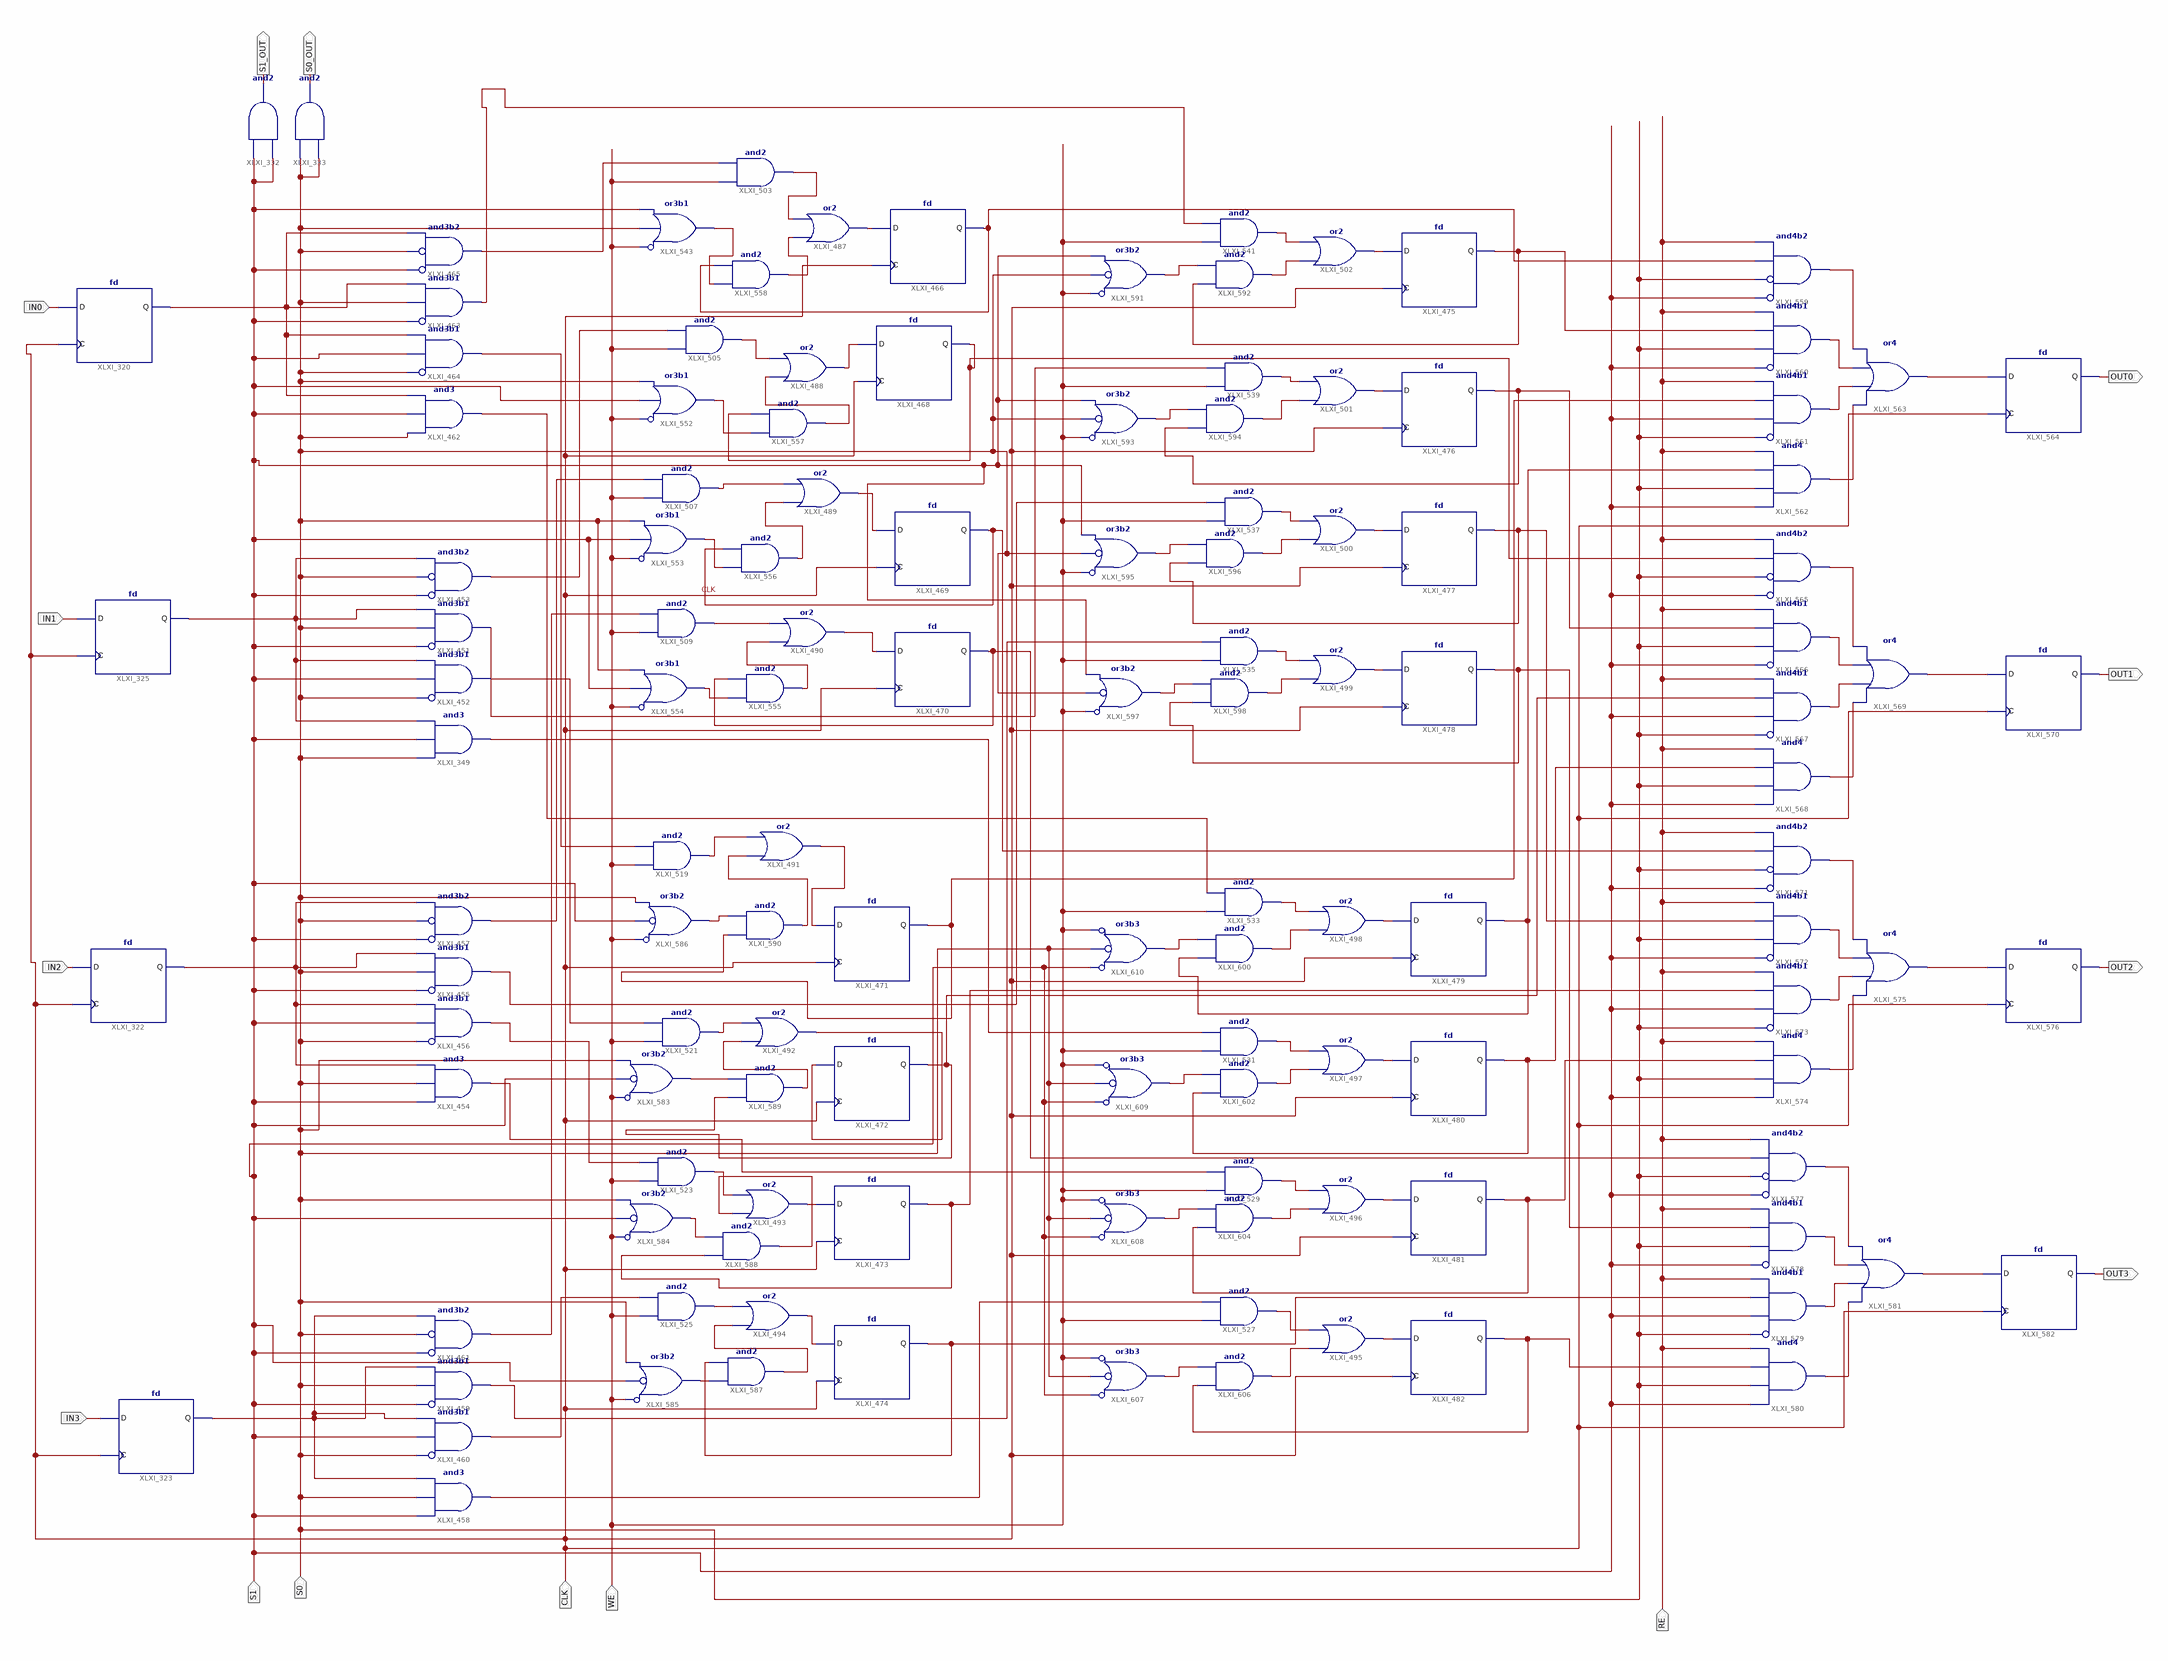
[diagram p0: schematic sheet 1]
// Xilinx ISE schematic regfile2.sch (spartan3e) as structural Verilog: 126 symbols, 15 ports
module regfile2 (
  input  S1,
  input  S0,
  input  IN3,
  input  IN2,
  input  IN1,
  input  IN0,
  input  CLK,
  input  WE,
  input  RE,
  output S1_OUT,
  output S0_OUT,
  output OUT0,
  output OUT1,
  output OUT2,
  output OUT3
);

  wire XLXN_934, XLXN_937, XLXN_940, XLXN_943, XLXN_989, XLXN_990, XLXN_991, XLXN_992, XLXN_993, XLXN_994,
       XLXN_995, XLXN_996, XLXN_997, XLXN_998, XLXN_999, XLXN_1000, XLXN_1001, XLXN_1002, XLXN_1003,
       XLXN_1004, XLXN_1056, XLXN_1057, XLXN_1058, XLXN_1059, XLXN_1060, XLXN_1061, XLXN_1062, XLXN_1063,
       XLXN_1065, XLXN_1067, XLXN_1068, XLXN_1071, XLXN_1073, XLXN_1075, XLXN_1077, XLXN_1079, XLXN_1081,
       XLXN_1083, XLXN_1085, XLXN_1086, XLXN_1088, XLXN_1090, XLXN_1091, XLXN_1092, XLXN_1093, XLXN_1094,
       XLXN_1095, XLXN_1096, XLXN_1097, XLXN_1098, XLXN_1100, XLXN_1126, XLXN_1134, XLXN_1146, XLXN_1151,
       XLXN_1154, XLXN_1155, XLXN_1156, XLXN_1157, XLXN_1158, XLXN_1159, XLXN_1160, XLXN_1161, XLXN_1162,
       XLXN_1163, XLXN_1164, XLXN_1165, XLXN_1166, XLXN_1167, XLXN_1168, XLXN_1169, XLXN_1170, XLXN_1171,
       XLXN_1172, XLXN_1173, XLXN_1174, XLXN_1175, XLXN_1176, XLXN_1201, XLXN_1202, XLXN_1203, XLXN_1204,
       XLXN_1206, XLXN_1207, XLXN_1208, XLXN_1209, XLXN_1215, XLXN_1232, XLXN_1233, XLXN_1234, XLXN_1235,
       XLXN_1236, XLXN_1237, XLXN_1238, XLXN_1240, XLXN_1241, XLXN_1248, XLXN_1249, XLXN_1250, XLXN_1251,
       XLXN_1252, XLXN_1253, XLXN_1254, XLXN_1255, XLXN_1256, XLXN_1257, XLXN_1258, XLXN_1259, XLXN_1262,
       XLXN_1263, XLXN_1264, XLXN_1265, XLXN_1266, XLXN_1267, XLXN_1268, XLXN_1269, XLXN_1270, XLXN_1271,
       XLXN_1272, XLXN_1273;

  and XLXI_332 (S1_OUT, S1, S1);
  and XLXI_333 (S0_OUT, S0, S0);
  and XLXI_349 (XLXN_1203, S0, S1, XLXN_937);
  fd XLXI_323 (.C(CLK), .D(IN3), .Q(XLXN_943));
  fd XLXI_322 (.C(CLK), .D(IN2), .Q(XLXN_940));
  fd XLXI_325 (.C(CLK), .D(IN1), .Q(XLXN_937));
  fd XLXI_320 (.C(CLK), .D(IN0), .Q(XLXN_934));
  and XLXI_451 (XLXN_1201, ~S1, S0, XLXN_937);  // and3b1
  and XLXI_452 (XLXN_1202, ~S0, S1, XLXN_937);  // and3b1
  and XLXI_453 (XLXN_1154, ~S1, ~S0, XLXN_937);  // and3b2
  and XLXI_454 (XLXN_1206, S1, S0, XLXN_940);
  and XLXI_455 (XLXN_1204, ~S1, S0, XLXN_940);  // and3b1
  and XLXI_456 (XLXN_1215, ~S0, S1, XLXN_940);  // and3b1
  and XLXI_457 (XLXN_1155, ~S1, ~S0, XLXN_940);  // and3b2
  and XLXI_458 (XLXN_1209, S1, S0, XLXN_943);
  and XLXI_459 (XLXN_1207, ~S1, S0, XLXN_943);  // and3b1
  and XLXI_460 (XLXN_1208, ~S0, S1, XLXN_943);  // and3b1
  and XLXI_461 (XLXN_1156, ~S1, ~S0, XLXN_943);  // and3b2
  and XLXI_462 (XLXN_1092, S0, S1, XLXN_934);
  and XLXI_463 (XLXN_1090, ~S1, S0, XLXN_934);  // and3b1
  and XLXI_464 (XLXN_1091, ~S0, S1, XLXN_934);  // and3b1
  and XLXI_465 (XLXN_1088, ~S1, ~S0, XLXN_934);  // and3b2
  fd XLXI_469 (.C(CLK), .D(XLXN_991), .Q(XLXN_1094));
  fd XLXI_470 (.C(CLK), .D(XLXN_992), .Q(XLXN_1093));
  or XLXI_489 (XLXN_991, XLXN_1060, XLXN_1061);
  or XLXI_490 (XLXN_992, XLXN_1062, XLXN_1063);
  and XLXI_507 (XLXN_1061, WE, XLXN_1155);
  and XLXI_509 (XLXN_1063, WE, XLXN_1156);
  fd XLXI_471 (.C(CLK), .D(XLXN_993), .Q(XLXN_1097));
  fd XLXI_472 (.C(CLK), .D(XLXN_994), .Q(XLXN_1098));
  fd XLXI_473 (.C(CLK), .D(XLXN_995), .Q(XLXN_1237));
  fd XLXI_474 (.C(CLK), .D(XLXN_996), .Q(XLXN_1100));
  or XLXI_491 (XLXN_993, XLXN_1232, XLXN_1065);
  or XLXI_492 (XLXN_994, XLXN_1233, XLXN_1067);
  or XLXI_493 (XLXN_995, XLXN_1234, XLXN_1068);
  or XLXI_494 (XLXN_996, XLXN_1235, XLXN_1071);
  and XLXI_519 (XLXN_1065, WE, XLXN_1091);
  and XLXI_521 (XLXN_1067, WE, XLXN_1202);
  and XLXI_523 (XLXN_1068, WE, XLXN_1215);
  and XLXI_525 (XLXN_1071, WE, XLXN_1208);
  fd XLXI_479 (.C(CLK), .D(XLXN_1000), .Q(XLXN_1263));
  fd XLXI_480 (.C(CLK), .D(XLXN_999), .Q(XLXN_1267));
  fd XLXI_481 (.C(CLK), .D(XLXN_998), .Q(XLXN_1269));
  fd XLXI_482 (.C(CLK), .D(XLXN_997), .Q(XLXN_1271));
  or XLXI_495 (XLXN_997, XLXN_1272, XLXN_1073);
  or XLXI_496 (XLXN_998, XLXN_1273, XLXN_1075);
  or XLXI_497 (XLXN_999, XLXN_1265, XLXN_1077);
  or XLXI_498 (XLXN_1000, XLXN_1264, XLXN_1079);
  and XLXI_527 (XLXN_1073, WE, XLXN_1209);
  and XLXI_529 (XLXN_1075, WE, XLXN_1206);
  and XLXI_531 (XLXN_1077, WE, XLXN_1203);
  and XLXI_533 (XLXN_1079, WE, XLXN_1092);
  and XLXI_541 (XLXN_1086, WE, XLXN_1090);
  and XLXI_539 (XLXN_1085, WE, XLXN_1201);
  and XLXI_537 (XLXN_1083, WE, XLXN_1204);
  and XLXI_535 (XLXN_1081, WE, XLXN_1207);
  or XLXI_502 (XLXN_1004, XLXN_1248, XLXN_1086);
  or XLXI_501 (XLXN_1003, XLXN_1251, XLXN_1085);
  or XLXI_500 (XLXN_1002, XLXN_1256, XLXN_1083);
  or XLXI_499 (XLXN_1001, XLXN_1257, XLXN_1081);
  fd XLXI_478 (.C(CLK), .D(XLXN_1001), .Q(XLXN_1259));
  fd XLXI_477 (.C(CLK), .D(XLXN_1002), .Q(XLXN_1255));
  fd XLXI_476 (.C(CLK), .D(XLXN_1003), .Q(XLXN_1253));
  fd XLXI_475 (.C(CLK), .D(XLXN_1004), .Q(XLXN_1250));
  or XLXI_543 (XLXN_1126, ~WE, S0, S1);  // or3b1
  fd XLXI_466 (.C(CLK), .D(XLXN_989), .Q(XLXN_1096));
  or XLXI_487 (XLXN_989, XLXN_1056, XLXN_1057);
  and XLXI_503 (XLXN_1057, WE, XLXN_1088);
  fd XLXI_468 (.C(CLK), .D(XLXN_990), .Q(XLXN_1095));
  or XLXI_488 (XLXN_990, XLXN_1058, XLXN_1059);
  and XLXI_505 (XLXN_1059, WE, XLXN_1154);
  or XLXI_552 (XLXN_1134, ~WE, S1, S0);  // or3b1
  or XLXI_553 (XLXN_1146, ~WE, S1, S0);  // or3b1
  or XLXI_554 (XLXN_1151, ~WE, S1, S0);  // or3b1
  and XLXI_555 (XLXN_1062, XLXN_1151, XLXN_1093);
  and XLXI_556 (XLXN_1060, XLXN_1146, XLXN_1094);
  and XLXI_557 (XLXN_1058, XLXN_1134, XLXN_1095);
  and XLXI_558 (XLXN_1056, XLXN_1126, XLXN_1096);
  and XLXI_559 (XLXN_1160, ~S1, ~S0, XLXN_1096, RE);  // and4b2
  and XLXI_560 (XLXN_1159, ~S1, S0, XLXN_1250, RE);  // and4b1
  and XLXI_561 (XLXN_1158, ~S0, S1, XLXN_1097, RE);  // and4b1
  and XLXI_562 (XLXN_1157, S1, S0, XLXN_1263, RE);
  or XLXI_563 (XLXN_1161, XLXN_1157, XLXN_1158, XLXN_1159, XLXN_1160);
  fd XLXI_564 (.C(CLK), .D(XLXN_1161), .Q(OUT0));
  and XLXI_565 (XLXN_1165, ~S1, ~S0, XLXN_1095, RE);  // and4b2
  and XLXI_566 (XLXN_1164, ~S1, S0, XLXN_1253, RE);  // and4b1
  and XLXI_567 (XLXN_1163, ~S0, S1, XLXN_1098, RE);  // and4b1
  and XLXI_568 (XLXN_1162, S1, S0, XLXN_1267, RE);
  or XLXI_569 (XLXN_1166, XLXN_1162, XLXN_1163, XLXN_1164, XLXN_1165);
  fd XLXI_570 (.C(CLK), .D(XLXN_1166), .Q(OUT1));
  and XLXI_571 (XLXN_1170, ~S1, ~S0, XLXN_1094, RE);  // and4b2
  and XLXI_572 (XLXN_1169, ~S1, S0, XLXN_1255, RE);  // and4b1
  and XLXI_573 (XLXN_1168, ~S0, S1, XLXN_1237, RE);  // and4b1
  and XLXI_574 (XLXN_1167, S1, S0, XLXN_1269, RE);
  or XLXI_575 (XLXN_1171, XLXN_1167, XLXN_1168, XLXN_1169, XLXN_1170);
  fd XLXI_576 (.C(CLK), .D(XLXN_1171), .Q(OUT2));
  and XLXI_577 (XLXN_1175, ~S1, ~S0, XLXN_1093, RE);  // and4b2
  and XLXI_578 (XLXN_1174, ~S1, S0, XLXN_1259, RE);  // and4b1
  and XLXI_579 (XLXN_1173, ~S0, S1, XLXN_1100, RE);  // and4b1
  and XLXI_580 (XLXN_1172, S1, S0, XLXN_1271, RE);
  or XLXI_581 (XLXN_1176, XLXN_1172, XLXN_1173, XLXN_1174, XLXN_1175);
  fd XLXI_582 (.C(CLK), .D(XLXN_1176), .Q(OUT3));
  or XLXI_583 (XLXN_1238, ~WE, ~S1, S0);  // or3b2
  or XLXI_584 (XLXN_1240, ~WE, ~S1, S0);  // or3b2
  or XLXI_585 (XLXN_1236, ~WE, ~S1, S0);  // or3b2
  or XLXI_586 (XLXN_1241, ~WE, ~S1, S0);  // or3b2
  and XLXI_587 (XLXN_1235, XLXN_1236, XLXN_1100);
  and XLXI_588 (XLXN_1234, XLXN_1237, XLXN_1240);
  and XLXI_589 (XLXN_1233, XLXN_1098, XLXN_1238);
  and XLXI_590 (XLXN_1232, XLXN_1097, XLXN_1241);
  or XLXI_591 (XLXN_1249, ~WE, ~S0, S1);  // or3b2
  and XLXI_592 (XLXN_1248, XLXN_1250, XLXN_1249);
  or XLXI_593 (XLXN_1252, ~WE, ~S0, S1);  // or3b2
  and XLXI_594 (XLXN_1251, XLXN_1253, XLXN_1252);
  or XLXI_595 (XLXN_1254, ~WE, ~S0, S1);  // or3b2
  and XLXI_596 (XLXN_1256, XLXN_1255, XLXN_1254);
  or XLXI_597 (XLXN_1258, ~WE, ~S0, S1);  // or3b2
  and XLXI_598 (XLXN_1257, XLXN_1259, XLXN_1258);
  and XLXI_600 (XLXN_1264, XLXN_1263, XLXN_1262);
  and XLXI_602 (XLXN_1265, XLXN_1267, XLXN_1266);
  and XLXI_604 (XLXN_1273, XLXN_1269, XLXN_1268);
  and XLXI_606 (XLXN_1272, XLXN_1271, XLXN_1270);
  or XLXI_607 (XLXN_1270, ~S1, ~S0, ~WE);  // or3b3
  or XLXI_608 (XLXN_1268, ~S1, ~S0, ~WE);  // or3b3
  or XLXI_609 (XLXN_1266, ~S1, ~S0, ~WE);  // or3b3
  or XLXI_610 (XLXN_1262, ~S1, ~S0, ~WE);  // or3b3
endmodule
